# Altium project DCSupplyHub.PrjPcb
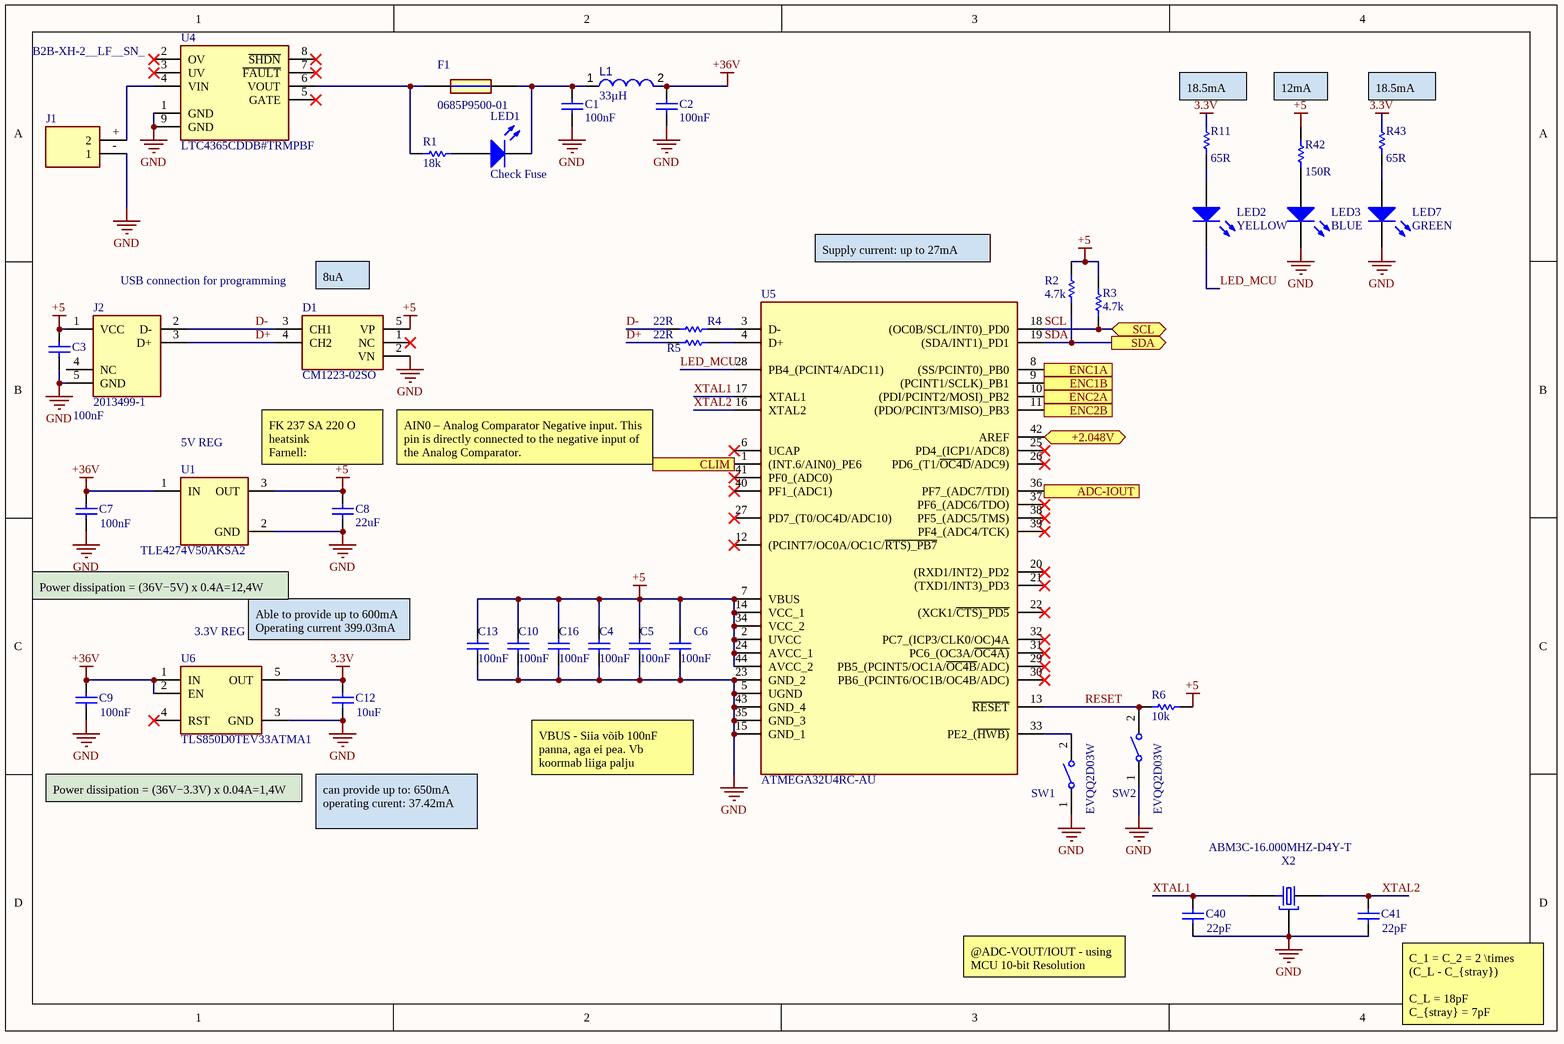
[diagram p0: v2-DCSupplyHub.SchDoc]
5 sheets, 113 parts. Net scope: flat (ports and power ports of the same name join across sheets).
Board files: DCSupplyHub-v2_20231213b.PcbDoc, DCSupplyHub-v2_20231212a.PcbDoc
Sheets:
  v2-DCSupplyHub.SchDoc
  LOG.SchDoc
  VCONV-DAC.SchDoc
  PWM-DAC-PSU.SchDoc
  output&ext-modules.SchDoc

## Sheet v2-DCSupplyHub.SchDoc
size A4; SheetNumber: 1; SheetTotal: 5

### Parts
C1  value 100nF  [Cap_0603]  (hidden comment: Cap)
C2  value 100nF  [Cap_0603]  (hidden comment: Cap)
C3  value 100nF  [Cap_0603]  (hidden comment: Cap)
C4  value 100nF  [Cap_0603]  (hidden comment: Cap)
C5  value 100nF  [Cap_0603]  (hidden comment: Cap)
C6  value 100nF  [Cap_0603]  (hidden comment: Cap)
C7  value 100nF  [Cap_0603]  (hidden comment: Cap)
C8  value 22uF  [Cap_0603]  (hidden comment: Cap)
C9  value 100nF  [Cap_0603]  (hidden comment: Cap)
C10  value 100nF  [Cap_0603]  (hidden comment: Cap)
C12  value 10uF  [Cap_0603]  (hidden comment: Cap)
C13  value 100nF  [Cap_0603]  (hidden comment: Cap)
C16  value 100nF  [Cap_0603]  (hidden comment: Cap)
C40  value 22pF  [Cap_0603]  (hidden comment: Cap)
C41  value 22pF  [Cap_0603]  (hidden comment: Cap)
D1  CM1223-02SO  [SOT95P280X145-5N]
F1  0685P9500-01  [FUSC3216X83N]  (value not drawn)
J1  B2B-XH-2__LF__SN_  [B2BXH2LFSN]
J2  2013499-1  [2013499-1]
L1  value 33µH  [WE-LQS 4018]  (hidden comment: 74404042330)
LED1  Check Fuse  [LED_SMD_0805_R]
LED2  YELLOW  [LED_SMD_0805_R]
LED3  BLUE  [LED_SMD_0805_R]
LED7  GREEN  [LED_SMD_0805_R]
R1  value 18k  [RES_0805]  (hidden comment: Res1)
R2  value 4.7k  [RES_0805]  (hidden comment: Res1)
R3  value 4.7k  [RES_0805]  (hidden comment: Res1)
R4  value 22R  [RES_0805]  (hidden comment: Res1)
R5  value 22R  [RES_0805]  (hidden comment: Res1)
R6  value 10k  [RES_0805]  (hidden comment: Res1)
R11  value 65R  [RES_0805]  (hidden comment: Res1)
R42  value 150R  [RES_0805]  (hidden comment: Res1)
R43  value 65R  [RES_0805]  (hidden comment: Res1)
SW1  EVQQ2D03W  [EVQQ2D03W]
SW2  EVQQ2D03W  [EVQQ2D03W]
U1  TLE4274V50AKSA2  [TO254P440X1000X2110-3P]
U4  LTC4365CDDB#PBF  [SON50P200X300X80-9N-D]  (value not drawn)
U5  ATMEGA32U4-AU  [QFP80P1200X1200X120-44N]  (value not drawn)
U6  TLS850D0TEV33ATMA1  [BTS6143D]
X2  ABM3C-16.000MHZ-D4Y-T  [ABM3C16000MHZD4YT]

### Ports
+2.048V (bidir), ADC-IOUT (in), CLIM (in), ENC1A (in), ENC1B (in), ENC2A (in), ENC2B (in), SCL (bidir), SDA (out)

### Nets
3.3V: C12.2 R11.1 R43.1 U6.5(OUT)
+5: C3.2 C4.2 C5.2 C6.2 C8.1 C10.2 C13.2 C16.2 D1.5(VP) J2.1(VCC) R2.2 R3.2 R6.1 R42.1 U1.3(OUT) U5.2(UVCC) U5.7(VBUS) U5.14(VCC_1) U5.24(AVCC_1) U5.34(VCC_2) U5.44(AVCC_2)
+36V: C2.1 C7.2 C9.2 L1.2 U1.1(IN) U6.1(IN) U6.2(EN)
GND: C1.2 C2.2 C3.1 C4.1 C5.1 C6.1 C7.1 C8.2 C9.1 C10.1 C12.1 C13.1 C16.1 C40.1 C41.1 D1.2(VN) J1.-(1) J2.5(GND) LED3.2(K) LED7.2(K) SW1.1 SW2.1 U1.2(GND) U4.1(GND) U4.9(GND) U5.5(UGND) U5.15(GND_1) U5.23(GND_2) U5.35(GND_3) U5.43(GND_4) U6.3(GND) X2.2(GND) X2.4(GND)
D+: D1.4(CH2) J2.3(D+) R5.2
D-: D1.3(CH1) J2.2(D-) R4.2
LED_MCU: LED2.2(K) U5.28(PB4_(PCINT4/ADC11))
RESET: R6.2 SW2.2 U5.13(~{RESET})
SCL: R3.1 U5.18((OC0B/SCL/INT0)_PD0) ; port SCL
SDA: R2.1 U5.19((SDA/INT1)_PD1) ; port SDA
XTAL1: C40.2 U5.17(XTAL1) X2.1
XTAL2: C41.2 U5.16(XTAL2) X2.3
NetC1_1: C1.1 F1.2 L1.1 LED1.2(K)
NetC28_1: U5.36(PF7_(ADC7/TDI)) ; port ADC-IOUT
NetC33_1: U5.8((SS/PCINT0)_PB0) ; port ENC1A
NetC34_1: U5.9((PCINT1/SCLK)_PB1) ; port ENC1B
NetC42_1: U5.10((PDI/PCINT2/MOSI)_PB2) ; port ENC2A
NetC43_1: U5.11((PDO/PCINT3/MISO)_PB3) ; port ENC2B
NetF1_1: F1.1 R1.2 U4.6(VOUT)
NetJ1_+: J1.+(2) U4.4(VIN)
NetLED1_1: LED1.1(A) R1.1
NetLED2_1: LED2.1(A) R11.2
NetLED3_1: LED3.1(A) R42.2
NetLED7_1: LED7.1(A) R43.2
NetQ2_1: U5.1((INT.6/AIN0)_PE6) ; port CLIM
NetR4_1: R4.1 U5.3(D-)
NetR5_1: R5.1 U5.4(D+)
NetSW1_2: SW1.2 U5.33(PE2_(~{HWB)})
NetU5_42: U5.42(AREF) ; port +2.048V

Not connected (* = marked no-connect by the designer): D1 1(NC)*; J2 4(NC); U4 2(OV)* 3(UV)* 5(GATE)* 7(~{FAULT})* 8(~{SHDN})*; U5 6(UCAP)* 12((PCINT7/OC0A/OC1C/~{RTS)_PB7})* 20((RXD1/INT2)_PD2)* 21((TXD1/INT3)_PD3)* 22((XCK1/~{CTS)_PD5})* 25(PD4_(ICP1/ADC8))* 26(PD6_(T1/~{OC4D}/ADC9))* 27(PD7_(T0/OC4D/ADC10))* 29(PB5_(PCINT5/OC1A/~{OC4B}/ADC))* 30(PB6_(PCINT6/OC1B/OC4B/ADC))* 31(PC6_(OC3A/~{OC4A)})* 32(PC7_(ICP3/CLK0/OC)4A)* 37(PF6_(ADC6/TDO))* 38(PF5_(ADC5/TMS))* 39(PF4_(ADC4/TCK))* 40(PF1_(ADC1))* 41(PF0_(ADC0))*; U6 4(RST)*

### Notes on the sheet
- (near R11) 18.5mA
- 12mA
- (near R43) 18.5mA
- USB connection for programming
- (near D1) 8uA
- Supply current: up to 27mA
- 5V REG
- FK 237 SA 220 O heatsink
  Farnell:
- AIN0 – Analog Comparator Negative input. This pin is directly connected to the negative input of the Analog Comparator.
- Power dissipation = (36V−5V) x 0.4A=12,4W
- (near U6) 3.3V REG
- Able to provide up to 600mA
  Operating current 399.03mA
- VBUS - Siia võib 100nF panna, aga ei pea. Vb koormab liiga palju
- Power dissipation = (36V−3.3V) x 0.04A=1,4W
- can provide up to: 650mA
  operating curent: 37.42mA
- @ADC-VOUT/IOUT - using MCU 10-bit Resolution
- (near C41) C_1 = C_2 = 2 \times (C_L - C_{stray})
  C_L = 18pF
  C_{stray} = 7pF
- (in symbol ATMEGA32U4-AU) ATMEGA32U4RC-AU
- (in symbol LTC4365CDDB#PBF) LTC4365CDDB#TRMPBF

### Library data of the parts
C1-C10 C12 C13 C16 C40 C41 = Cap: Capacitor; Published: 8-Jun-2000; LatestRevisionDate: 17-Jul-2002; LatestRevisionNote: Re-released for DXP Platform.; PackageReference: RAD-0.3; Publisher: Altium Limited; PackageDescription: Radial Cap, Thru-Hole; 2 Leads; 0.3 in Pin Spacing
D1 = CM1223-02SO: TVS Diode (Uni-directional); Manufacturer_Name: onsemi; Datasheet Link: https://www.onsemi.com/pdf/datasheet/cm1223-d.pdf; Height: 1.45mm; Manufacturer_Part_Number: CM1223-02SO; Mouser Part Number: 748-CM1223-02SO; Mouser Price/Stock: https://www.mouser.co.uk/ProductDetail/onsemi/CM1223-02SO?qs=lLuKAerq7nnvVg3rEtIojA%3D%3D; ComponentLink1Description: Datasheet; ComponentLink1URL: https://www.onsemi.com/pdf/datasheet/cm1223-d.pdf
F1 = 0685P9500-01: Fuse Chip Fast Acting 50A 32V SMD Solder Pad 1206 3.2 X 1.58 X 0.63mm Ceramic T/R; Manufacturer_Name: Bel Circuit Protection; Geometry.Height: 0.83mm; Manufacturer_Part_Number: 0685P9500-01; Mouser Part Number: *; Mouser Price/Stock: *; Arrow Part Number: 0685P9500-01; Arrow Price/Stock: https://www.arrow.com/en/products/0685p9500-01/bel-group?region=europe; Datasheet Link: https://www.arrow.com/en/products/0685p9500-01/bel-group
J1 = B2B-XH-2__LF__SN_: Connector; Manufacturer_Name: JST (JAPAN SOLDERLESS TERMINALS); Manufacturer_Part_Number: B2B-XH-2 (LF)(SN); Datasheet Link: http://uk.rs-online.com/web/p/products/1755297; Height: 7mm; Arrow Part Number: B2B-XH-2 (LF)(SN); Arrow Price/Stock: https://www.arrow.com/en/products/b2b-xh-2-lf-sn/jst-manufacturing?region=europe
J2 = 2013499-1: Connector; Manufacturer_Name: TE Connectivity; Datasheet Link: http://www.te.com/commerce/DocumentDelivery/DDEController?Action=showdoc&DocId=Customer+Drawing%7F2013499%7FB2%7Fpdf%7FEnglish%7FENG_CD_2013499_B2.pdf%7F2013499-1; Manufacturer_Part_Number: 2013499-1; Mouser Part Number: 571-2013499-1; Mouser Price/Stock: https://www.mouser.co.uk/ProductDetail/TE-Connectivity/2013499-1?qs=TL6PIybY3BOLK37GbUYdng%3D%3D; Arrow Part Number: 2013499-1; Arrow Price/Stock: https://www.arrow.com/en/products/2013499-1/te-connectivity?region=nac; ComponentLink1Description: Datasheet; ComponentLink1URL: https://cdn.amphenol-cs.com/media/wysiwyg/files/documentation/datasheet/inputoutput/io_usb_micro.pdf
L1 = CMP-006-00018-3: WE-LQS SMD Power Inductor, L=33 µH; Tolerance: 20%; ComponentLink2URL: http://katalog.we-online.de/pbs/datasheet/74404042330.pdf; ComponentLink1URL: http://www.we-online.com; ComponentLink2Description: Datasheet; Pins: 2; ComponentLink1Description: Manufacturer URL
LED1-LED3 LED7 = LED2: Typical RED, GREEN, YELLOW, AMBER GaAs LED; Published: 8-Jun-2000; LatestRevisionDate: 17-Jul-2002; LatestRevisionNote: Re-released for DXP Platform.; PackageVersion: Feb-2002; PackageReference: 3.2X1.6X1.1; Publisher: Altium Limited; PackageDescription: SM LED; 2 Flat Leads
R1-R6 R11 R42 R43 = Res1: Resistor; Published: 8-Jun-2000; LatestRevisionDate: 17-Jul-2002; LatestRevisionNote: Re-released for DXP Platform.; PackageReference: AXIAL-0.3; Publisher: Altium Limited; PackageDescription: Axial Device, Thru-Hole; 2 Leads; 0.3 in Pin Spacing
SW1 SW2 = SW-SPST-2_C: FSMSM Push Button Switch, 50 mA, -35 to 85 degC, 2-Pin SMD, RoHS, Tape and Reel; Manufacturer: TE Connectivity; Voltage Rating (DC): 24V; Electrical Life: 20000Cycles; Operating Force: 180gf; Switch Travel: 0.25mm; Contact Current Rating: 50mA; Case\/Package: SMD/SMT; Actuator Length: 1.07mm; Throw Configuration: SPST; Actuator Material: Polyamide; Contact Resistance: 100mOhm; Illumination Type: Illuminated; Max Voltage Rating (DC): 12V; Manufacturer URL: http://www.te.com/; Lead Free: LeadFree; Packaging: TapeandReel; Min Operating Temperature: -35degC; Mechanical Life: 20000Cycles; Mount: SurfaceMount; REACH SVHC: Unknown; Package Quantity: 1800; Package Reference: FSMSMTR; RoHSCompliant: true; Max Operating Temperature: 85degC; Orientation: Straight; ELV: Compliant; Datasheet URL: http://www.te.com/commerce/DocumentDelivery/DDEController?Action=showdoc&DocId=Customer+Drawing%7F1437566-3%7FC2%7Fpdf%7FEnglish%7FENG_CD_1437566-3_C2_1437566_3_1_c.dwg.pdf%7F1437566-4; Package Description: 2-Pin Surface Mount Device, Body 6 x 3.5 mm, Pitch 9.19 mm; Current Rating: 50mA; Contact Plating: Silver; Termination: GullWing; Datasheet Version: Rev. C2, 08/2014; Contact Material: Brass; Mounting Technology: SurfaceMount; ComponentLink1Description: Datasheet; ComponentLink1URL: https://www.farnell.com/datasheets/2244072.pdf
U1 = TLE4274DV50ATMA2: LDO, FIXED, 5V, 0.4A, -40 TO 150DEG C; Manufacturer_Name: Infineon; Datasheet Link: https://www.mouser.com/datasheet/2/196/Infineon-TLE4274-DS-v01_70-EN-1133217.pdf; Height: 2mm; Manufacturer_Part_Number: TLE4274DV50ATMA2; Mouser Part Number: 726-TLE4274DV50ATMA2; Mouser Price/Stock: https://www.mouser.co.uk/ProductDetail/Infineon-Technologies/TLE4274DV50ATMA2/?qs=IxCaM9nJKKWmxkR9ksyK2Q%3D%3D; Arrow Part Number: TLE4274DV50ATMA2; Arrow Price/Stock: https://www.arrow.com/en/products/tle4274dv50atma2/infineon-technologies-ag?region=nac; ComponentLink1Description: Datasheet; ComponentLink1URL: https://www.mouser.com/datasheet/2/196/Infineon-TLE4274-DS-v01_70-EN-1133217.pdf
U4 = LTC4365CDDB#PBF: vervoltage, Undervoltage and Reverse Supply Protection Controller; Manufacturer_Name: Analog Devices; Datasheet Link: http://cds.linear.com/docs/en/datasheet/4365fa.pdf; Height: 0.8mm; Manufacturer_Part_Number: LTC4365CDDB#PBF; Mouser Part Number: 584-LTC4365CDDB#PBF; Mouser Price/Stock: https://www.mouser.com/Search/Refine.aspx?Keyword=584-LTC4365CDDB%23PBF; ComponentLink1Description: Datasheet; ComponentLink1URL: https://www.analog.com/media/en/technical-documentation/data-sheets/LTC4365.pdf
U5 = ATMEGA32U4-AU: MCU AVR 32K FLASH 16MHZ 44-TQFP Atmel ATMEGA32U4-AU, 8bit AVR Microcontroller, 16MHz, 1 kB, 32 kB Flash, 44-Pin TQFP; Manufacturer_Name: Microchip; Geometry.Height: 1.2mm; Manufacturer_Part_Number: ATMEGA32U4-AU; Mouser Part Number: 556-ATMEGA32U4-AU; Mouser Price/Stock: https://www.mouser.co.uk/ProductDetail/Microchip-Technology/ATMEGA32U4-AU?qs=SSucg2PyLi7mKWjHIsNJ3w%3D%3D; Arrow Part Number: ATMEGA32U4-AU; Arrow Price/Stock: https://www.arrow.com/en/products/atmega32u4-au/microchip-technology?region=nac; Datasheet Link: http://www.atmel.com/images/atmel-7766-8-bit-avr-atmega16u4-32u4_summary.pdf; ComponentLink1Description: Datasheet; ComponentLink1URL: https://ww1.microchip.com/downloads/en/DeviceDoc/Atmel-7766-8-bit-AVR-ATmega16U4-32U4_Datasheet.pdf
U6 = TLS850D0TEV33ATMA1: LDO VOltage regulator; Manufacturer_Name: Infineon; Datasheet Link: https://www.arrow.com/en/products/tls850d0tev33atma1/infineon-technologies-ag; Height: 2mm; Manufacturer_Part_Number: TLS850D0TEV33ATMA1; Mouser Part Number: 726-TLS850D0TEV33ATM; Mouser Price/Stock: https://www.mouser.co.uk/ProductDetail/Infineon-Technologies/TLS850D0TEV33ATMA1?qs=lJkB7%252BtQNiOAXKJxyf22ag%3D%3D; Arrow Part Number: TLS850D0TEV33ATMA1; Arrow Price/Stock: https://www.arrow.com/en/products/tls850d0tev33atma1/infineon-technologies-ag; ComponentLink1Description: Datasheet; ComponentLink1URL: https://4donline.ihs.com/images/VipMasterIC/IC/INFN/INFN-S-A0003268371/INFN-S-A0003268371-1.pdf?hkey=6D3A4C79FDBF58556ACFDE234799DDF0
X2 = ABM3C-16.000MHZ-D4Y-T: 16MHz Â±30ppm Crystal 18pF 50 Ohms 4-SMD, No Lead; MF: Abracon; Price: None; Value: *; Package: SMD-4 Abracon; Availability: Unavailable; SnapEDA_Link: https://www.snapeda.com/parts/ABM3C-16.000MHZ-D4Y-T/Abracon%20LLC/view-part/463692/?ref=snap; MP: ABM3C-16.000MHZ-D4Y-T; Supplier 1: Arrow Electronics; Supplier Part Number 1: ABM3C-16.000MHZ-D4Y-T; ComponentLink1Description: Datasheet; ComponentLink1URL: https://www.mouser.ee/datasheet/2/3/abm3c-1775120.pdf

## Sheet LOG.SchDoc
size A4; SheetNumber: 2; SheetTotal: 5
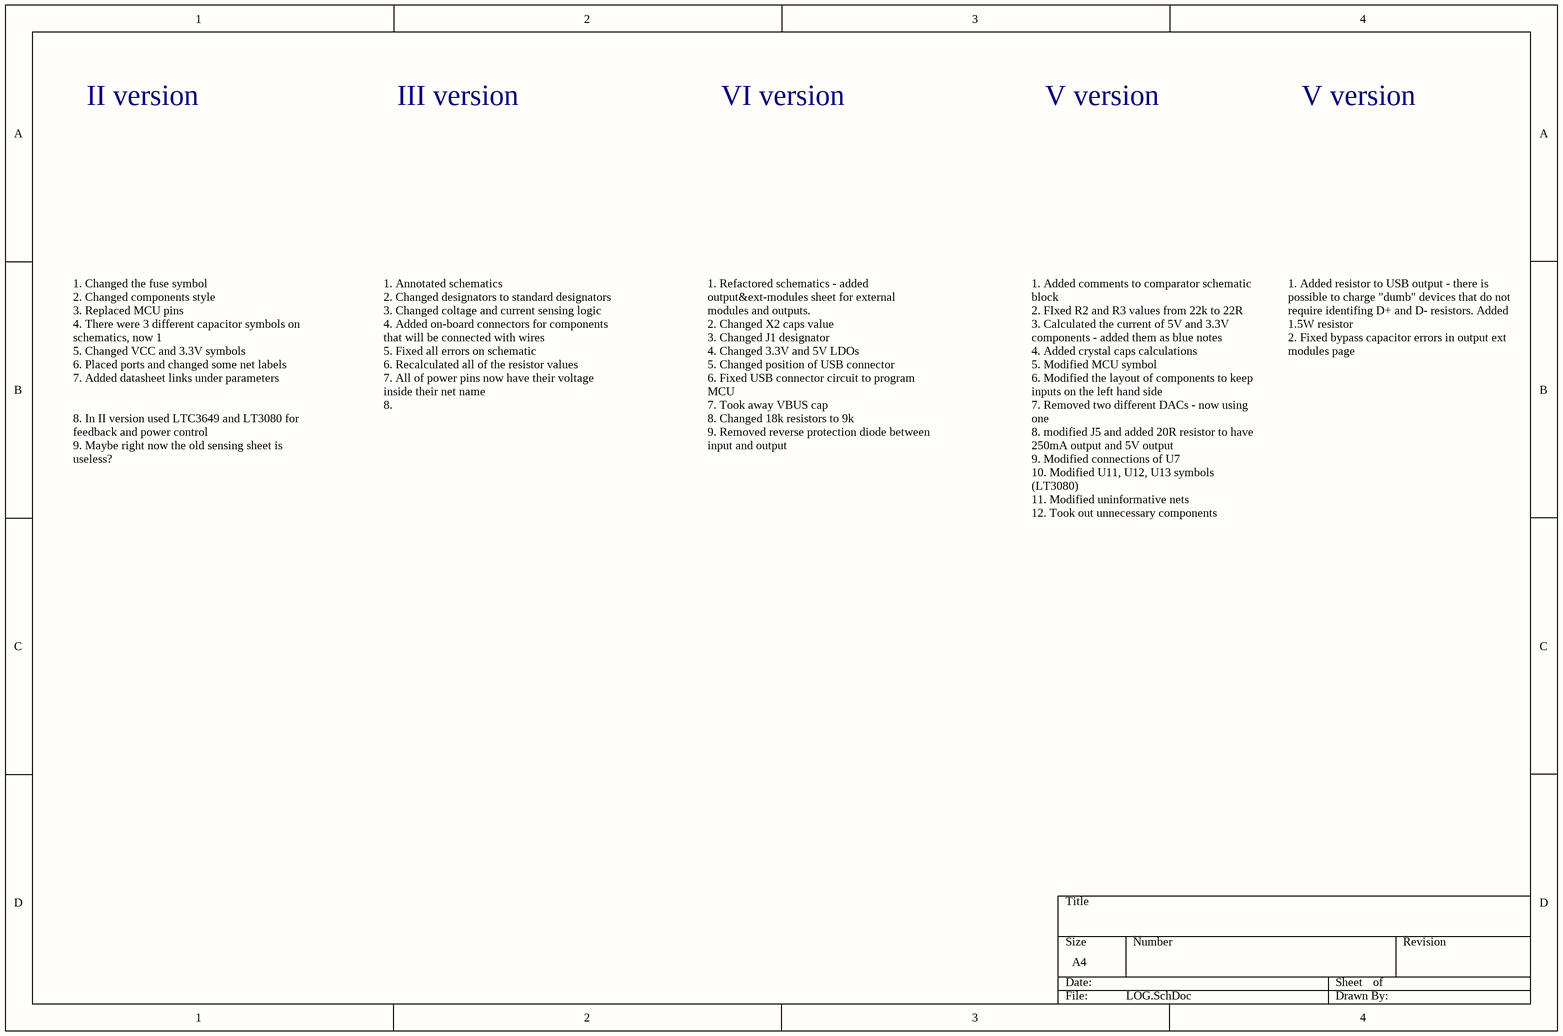
[diagram p1: LOG.SchDoc]

### Notes on the sheet
- II version
- III version
- VI version
- V version
- 1. Changed the fuse symbol
  2. Changed components style
  3. Replaced MCU pins
  4. There were 3 different capacitor symbols on schematics, now 1
  5. Changed VCC and 3.3V symbols
  6. Placed ports and changed some net labels
  7. Added datasheet links under parameters
  8. In II version used LTC3649 and LT3080 for feedback and power control
  9. Maybe right now the old sensing sheet is useless?
- 1. Annotated schematics
  2. Changed designators to standard designators
  3. Changed coltage and current sensing logic
  4. Added on-board connectors for components that will be connected with wires
  5. Fixed all errors on schematic
  6. Recalculated all of the resistor values
  7. All of power pins now have their voltage inside their net name
  8.
- 1. Refactored schematics - added output&ext-modules sheet for external modules and outputs.
  2. Changed X2 caps value
  3. Changed J1 designator
  4. Changed 3.3V and 5V LDOs
  5. Changed position of USB connector
  6. Fixed USB connector circuit to program MCU
  7. Took away VBUS cap
  8. Changed 18k resistors to 9k
  9. Removed reverse protection diode between input and output
- 1. Added comments to comparator schematic block
  2. FIxed R2 and R3 values from 22k to 22R
  3. Calculated the current of 5V and 3.3V components - added them as blue notes
  4. Added crystal caps calculations
  5. Modified MCU symbol
  6. Modified the layout of components to keep inputs on the left hand side
  7. Removed two different DACs - now using one
  8. modified J5 and added 20R resistor to have 250mA output and 5V output
  9. Modified connections of U7
  10. Modified U11, U12, U13 symbols (LT3080)
  11. Modified uninformative nets
  12. Took out unnecessary components
- 1. Added resistor to USB output - there is possible to charge "dumb" devices that do not require identifing D+ and D- resistors. Added 1.5W resistor
  2. Fixed bypass capacitor errors in output ext modules page

## Sheet VCONV-DAC.SchDoc
size A4; SheetNumber: 3; SheetTotal: 5
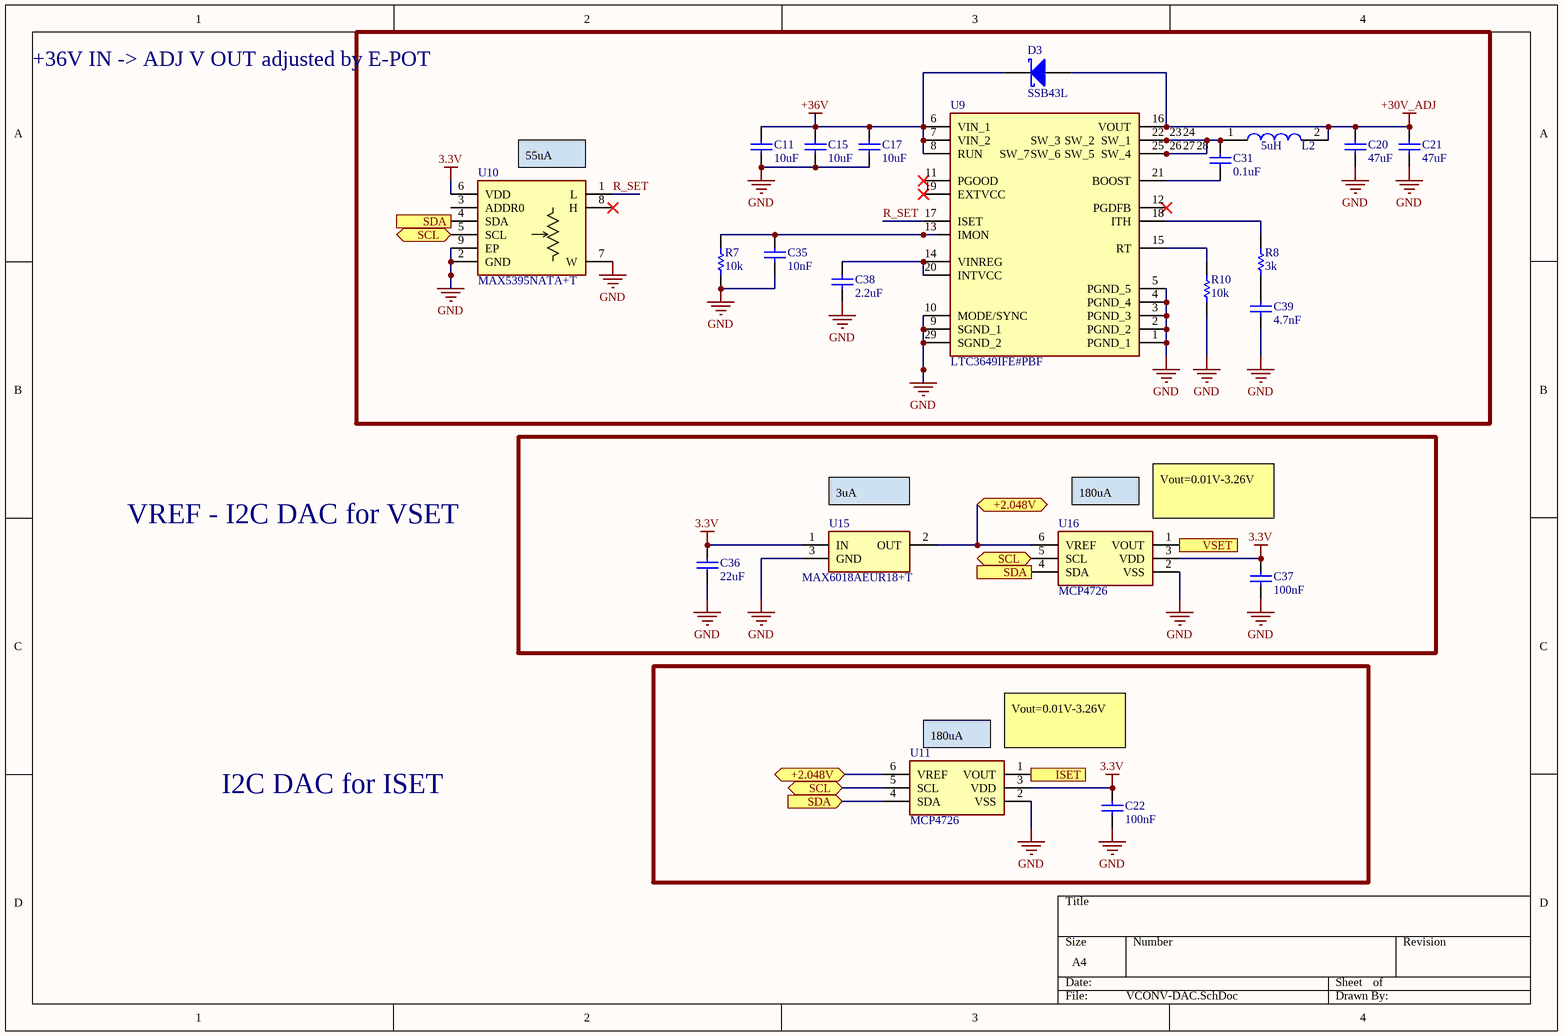
[diagram p2: VCONV-DAC.SchDoc]

### Parts
C11  value 10uF  [Cap_0603]  (hidden comment: Cap)
C15  value 10uF  [Cap_0603]  (hidden comment: Cap)
C17  value 10uF  [Cap_0603]  (hidden comment: Cap)
C20  value 47uF  [Cap_0603]  (hidden comment: Cap)
C21  value 47uF  [Cap_0603]  (hidden comment: Cap)
C22  value 100nF  [Cap_0603]  (hidden comment: Cap)
C31  value 0.1uF  [Cap_0603]  (hidden comment: Cap)
C35  value 10nF  [Cap_0603]  (hidden comment: Cap)
C36  value 22uF  [Cap_0603]  (hidden comment: Cap)
C37  value 100nF  [Cap_0603]  (hidden comment: Cap)
C38  value 2.2uF  [Cap_0603]  (hidden comment: Cap)
C39  value 4.7nF  [Cap_0603]  (hidden comment: Cap)
D3  SSB43L  [DO-214AA(SMB)]
L2  5uH  [IND_TCK-141_TRP]
R7  value 10k  [RES_0805]  (hidden comment: Res1)
R8  value 3k  [RES_0805]  (hidden comment: Res1)
R10  value 10k  [RES_0805]  (hidden comment: Res1)
U9  LTC3649IFE#PBF  [SOP65P640X120-29N]
U10  MAX5395NATA+T  [SON50P200X200X80-9N-D]
U11  MCP4726  [SOT95P270X145-6N]
U15  MAX6018AEUR18+T  [SOT95P237X112-3N]
U16  MCP4726  [SOT95P270X145-6N]

### Ports
+2.048V (bidir), ISET (out), SCL (bidir), SDA (in), VSET (out)

### Nets
3.3V: C22.1 C36.1 C37.1 U10.6(VDD) U11.3(VDD) U15.1(IN) U16.3(VDD)
+30V_ADJ: C20.1 C21.1 D3.A L2.2 U9.16(VOUT)
+36V: C11.1 C15.1 C17.1 D3.K U9.6(VIN_1) U9.7(VIN_2) U9.8(RUN)
GND: C11.2 C15.2 C17.2 C20.2 C21.2 C22.2 C35.2 C36.2 C37.2 C38.2 C39.2 R7.1 R10.1 U9.1(PGND_1) U9.2(PGND_2) U9.3(PGND_3) U9.4(PGND_4) U9.5(PGND_5) U9.9(SGND_1) U9.10(MODE/SYNC) U9.29(SGND_2) U10.2(GND) U10.7(W) U10.9(EP) U11.2(VSS) U15.3(GND) U16.2(VSS)
R_SET: U9.17(ISET) U10.1(L)
SCL: U10.5(SCL) U11.5(SCL) U16.5(SCL) ; port SCL
SDA: U10.4(SDA) U11.4(SDA) U16.4(SDA) ; port SDA
NetC31_1: C31.1 L2.1 U9.22(SW_1) U9.23(SW_2) U9.24(SW_3) U9.25(SW_4) U9.26(SW_5) U9.27(SW_6) U9.28(SW_7)
NetC31_2: C31.2 U9.21(BOOST)
NetC35_1: C35.1 R7.2 U9.13(IMON)
NetC38_1: C38.1 U9.14(VINREG) U9.20(INTVCC)
NetC39_1: C39.1 R8.1
NetR8_2: R8.2 U9.18(ITH)
NetR10_2: R10.2 U9.15(RT)
NetR32_2: U11.1(VOUT) ; port ISET
NetU3_3: U16.1(VOUT) ; port VSET
NetU5_42: U11.6(VREF) U15.2(OUT) U16.6(VREF) ; port +2.048V

Not connected (* = marked no-connect by the designer): U9 11(PGOOD)* 12(PGDFB)* 19(EXTVCC)*; U10 3(ADDR0) 8(H)*

### Notes on the sheet
- +36V IN -> ADJ V OUT adjusted by E-POT
- (near U10) 55uA
- (near U15) 3uA
- (near U16) 180uA
- (near U16) Vout=0.01V-3.26V
- VREF - I2C DAC for VSET
- (near U11) 180uA
- (near U11) Vout=0.01V-3.26V
- I2C DAC for ISET

### Library data of the parts
C11 C15 C17 C20-C22 C31 C35-C39 = Cap: Capacitor; Published: 8-Jun-2000; LatestRevisionDate: 17-Jul-2002; LatestRevisionNote: Re-released for DXP Platform.; PackageReference: RAD-0.3; Publisher: Altium Limited; PackageDescription: Radial Cap, Thru-Hole; 2 Leads; 0.3 in Pin Spacing
D3 = SSB43L: Schottky Rectifier, 40 V, 4 A, Single, DO-214AA (SMB), 2 Pins, 490 mV; Supplier 1: Farnell; Supplier Part Number 1: 1336556; ComponentLink1Description: Datasheet; ComponentLink1URL: https://4donline.ihs.com/images/VipMasterIC/IC/VISH/VISH-S-A0010452954/VISH-S-A0010476709-1.pdf?hkey=6D3A4C79FDBF58556ACFDE234799DDF0
L2 = TCK-141: FIXED IND 5.6UH 3.5A 90MOHM SMD; Mfr_Name: Traco Power; Type: DEV; Copyright: Copyright (C) 2023 Ultra Librarian. All rights reserved.; Manufacturer_Part_Number: TCK-141; RefDes: RefDes; ComponentLink1Description: Datasheet; ComponentLink1URL: https://www.tracopower.com/products/tck141.pdf
R7 R8 R10 = Res1: Resistor; Published: 8-Jun-2000; LatestRevisionDate: 17-Jul-2002; LatestRevisionNote: Re-released for DXP Platform.; PackageReference: AXIAL-0.3; Publisher: Altium Limited; PackageDescription: Axial Device, Thru-Hole; 2 Leads; 0.3 in Pin Spacing
U9 = LTC3649IFE#PBF: 60V, 4A Synchronous Step-Down Regulator with Rail-to-Rail Programmable Output; Manufacturer_Name: Analog Devices; Geometry.Height: 1.2mm; Manufacturer_Part_Number: LTC3649IFE#PBF; Mouser Part Number: 584-LTC3649IFE#PBF; Mouser Price/Stock: https://www.mouser.co.uk/ProductDetail/Analog-Devices/LTC3649IFEPBF?qs=oahfZPh6IALghjzowGYuFA%3D%3D; Arrow Part Number: LTC3649IFE#PBF; Arrow Price/Stock: https://www.arrow.com/en/products/ltc3649ifepbf/linear-technology; Datasheet Link: http://www.analog.com/media/en/technical-documentation/data-sheets/3649fb.pdf; Supplier 1: Digi-Key; Supplier Part Number 1: LTC3649IFE#PBF-ND; ComponentLink1Description: Datasheet; ComponentLink1URL: https://www.analog.com/media/en/technical-documentation/data-sheets/3649fb.pdf
U10 = MAX5395NATA+T: ingle, 256-Tap Volatile, I2C, Low-Voltage Linear / Taper Digital Potentiometer; Manufacturer_Name: Analog Devices; Datasheet Link: https://datasheets.maximintegrated.com/en/ds/MAX5395.pdf; Height: 0.8mm; Manufacturer_Part_Number: MAX5395NATA+T; Mouser Part Number: 700-MAX5395NATA+T; Mouser Price/Stock: https://www.mouser.co.uk/ProductDetail/Analog-Devices-Maxim-Integrated/MAX5395NATA%2bT?qs=0JU57JYmZjt6U4d8%252BEwekw%3D%3D; ComponentLink1Description: Datasheet; ComponentLink1URL: https://www.farnell.com/datasheets/2297485.pdf
U11 U16 = MCP4725A0T-E_CH: 12-Bit Digital-to-Analog Converter with EEPROM Memory; Manufacturer_Name: Microchip; Manufacturer_Part_Number: MCP4725A0T-E/CH; Datasheet Link: http://ww1.microchip.com/downloads/en/DeviceDoc/22039d.pdf; Height: 1.45mm; Mouser Part Number: 579-MCP4725A0TECH; Mouser Price/Stock: https://www.mouser.co.uk/ProductDetail/Microchip-Technology/MCP4725A0T-E-CH?qs=vkMqrgFpRajeQECZ3goc0A%3D%3D; Arrow Part Number: MCP4725A0T-E/CH; Arrow Price/Stock: https://www.arrow.com/en/products/mcp4725a0t-ech/microchip-technology?region=nac; ComponentLink1Description: Datasheet; ComponentLink1URL: http://ww1.microchip.com/downloads/en/DeviceDoc/22039d.pdf
U15 = MAX6018AEUR18+T: Precision, Micropower, 1.8V Supply, / Low-Dropout, SOT23 Voltage Reference; Manufacturer_Name: Analog Devices; Datasheet Link: https://datasheets.maximintegrated.com/en/ds/MAX6018-MAX6018B.pdf; Height: 1.12mm; Manufacturer_Part_Number: MAX6018AEUR18+T; Mouser Part Number: 700-MAX6018AEUR18T; Mouser Price/Stock: https://www.mouser.co.uk/ProductDetail/Maxim-Integrated/MAX6018AEUR18%2bT?qs=GxOUx7aO6nxTHpj7gtPQaw%3D%3D; ComponentLink1Description: Datasheet; ComponentLink1URL: https://datasheets.maximintegrated.com/en/ds/MAX6018-MAX6018B.pdf

## Sheet PWM-DAC-PSU.SchDoc
size A4; SheetNumber: 4; SheetTotal: 5
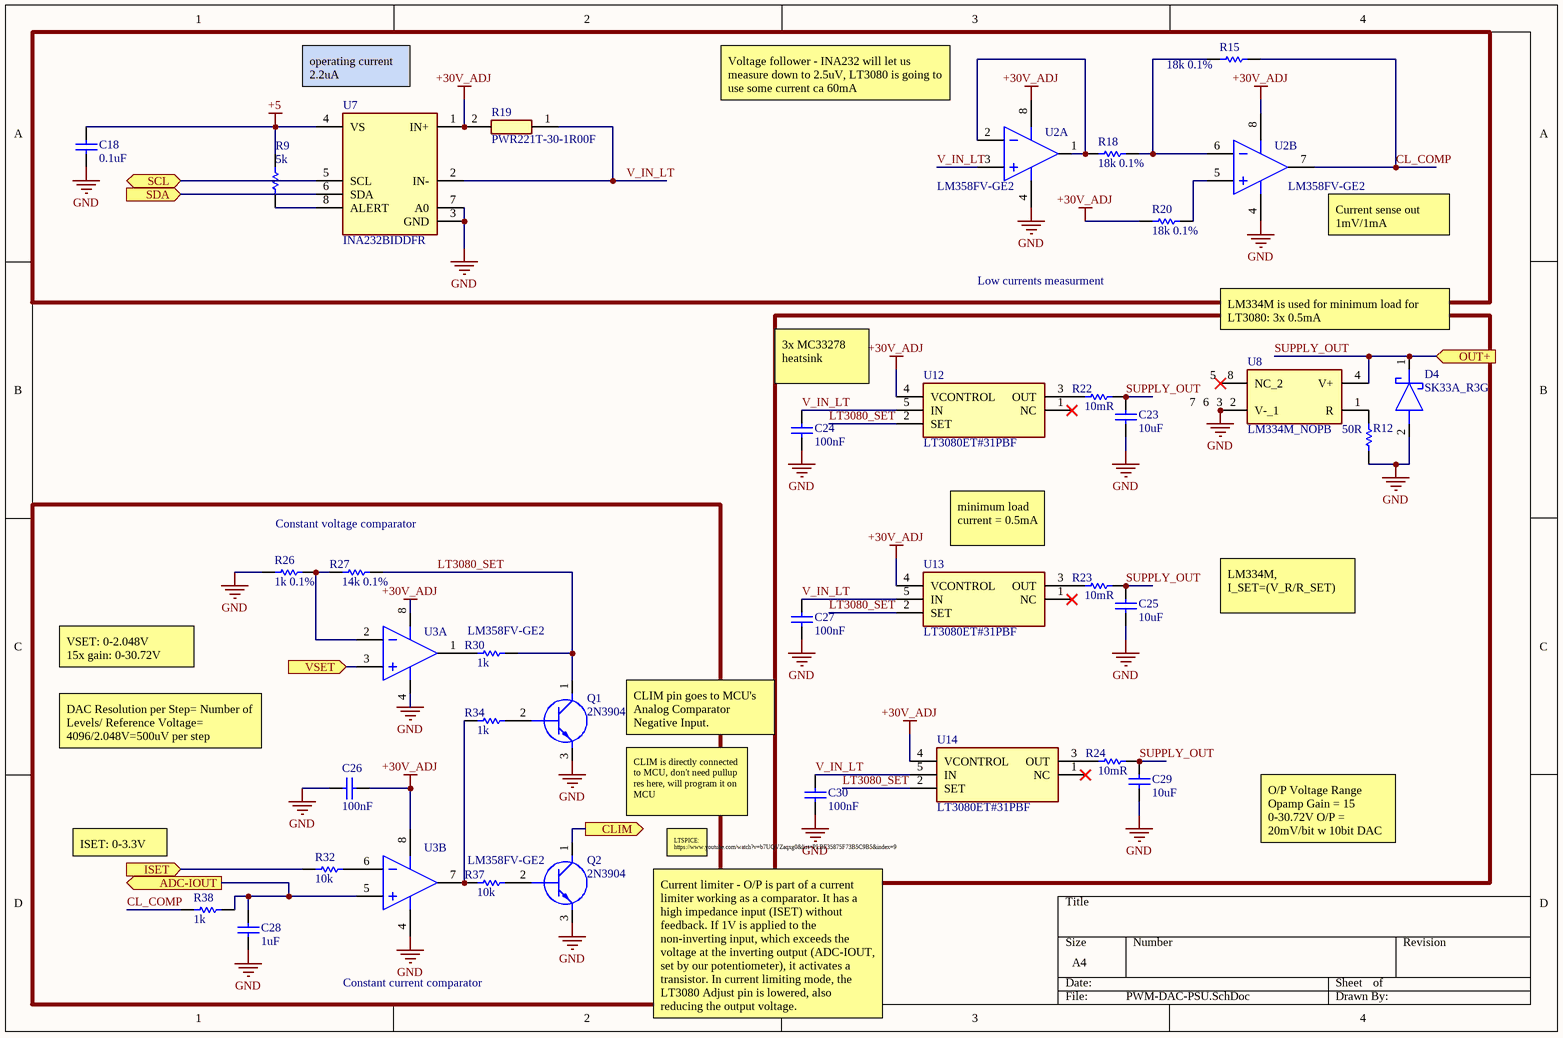
[diagram p3: PWM-DAC-PSU.SchDoc]

### Parts
C18  value 0.1uF  [Cap_0603]  (hidden comment: Cap)
C23  value 10uF  [Cap_0603]  (hidden comment: Cap)
C24  value 100nF  [Cap_0603]  (hidden comment: Cap)
C25  value 10uF  [Cap_0603]  (hidden comment: Cap)
C26  value 100nF  [Cap_0603]  (hidden comment: Cap)
C27  value 100nF  [Cap_0603]  (hidden comment: Cap)
C28  value 1uF  [Cap_0603]  (hidden comment: Cap)
C29  value 10uF  [Cap_0603]  (hidden comment: Cap)
C30  value 100nF  [Cap_0603]  (hidden comment: Cap)
D4  SK33A_R3G  [DIOM5126X250N]
Q1  2N3904  [LM431ACZ]
Q2  2N3904  [LM431ACZ]
R9  value 5k  [RES_0805]  (hidden comment: Res1)
R12  value 50R  [RES_0805]  (hidden comment: Res1)
R15  value 18k 0.1%  [RES_0805]  (hidden comment: Res1)
R18  value 18k 0.1%  [RES_0805]  (hidden comment: Res1)
R19  PWR221T-30-1R00F  [TO508P343X1041X1930-2P]
R20  value 18k 0.1%  [RES_0805]  (hidden comment: Res1)
R22  value 10mR  [RES_0805]  (hidden comment: Res1)
R23  value 10mR  [RES_0805]  (hidden comment: Res1)
R24  value 10mR  [RES_0805]  (hidden comment: Res1)
R26  value 1k 0.1%  [RES_0805]  (hidden comment: Res1)
R27  value 14k 0.1%  [RES_0805]  (hidden comment: Res1)
R30  value 1k  [RES_0805]  (hidden comment: Res1)
R32  value 10k  [RES_0805]  (hidden comment: Res1)
R34  value 1k  [RES_0805]  (hidden comment: Res1)
R37  value 10k  [RES_0805]  (hidden comment: Res1)
R38  value 1k  [RES_0805]  (hidden comment: Res1)
U2  LM358FV-GE2  [SOP65P640X135-8N]  (parts A,B of 2)
U3  LM358FV-GE2  [SOP65P640X135-8N]  (parts A,B of 2)
U7  INA232BIDDFR  [SOT65P280X110-8N]
U8  LM334M_NOPB  [SOIC127P600X175-8N]
U12  LT3080ET#31PBF  [LT3080ET31PBF]
U13  LT3080ET#31PBF  [LT3080ET31PBF]
U14  LT3080ET#31PBF  [LT3080ET31PBF]

### Blocks framed on the sheet
Low currents measurment: C18 R9 R15 R18-R20 U2 U7

### Ports
ADC-IOUT (out), CLIM (out), ISET (in), OUT+ (in), SCL (bidir), SDA (in), VSET (in)

### Nets
+5: C18.1 R9.2 U7.4(VS)
+30V_ADJ: C26.2 R19.2 R20.2 U2.8(VCC) U3.8(VCC) U7.1(IN+) U12.4(VCONTROL) U13.4(VCONTROL) U14.4(VCONTROL)
GND: C18.2 C23.1 C24.2 C25.1 C26.1 C27.2 C28.2 C29.1 C30.2 D4.2(A) Q1.3(E) Q2.3(E) R12.2 R26.1 U2.4(GND) U3.4(GND) U7.3(GND) U7.7(A0) U8.2(V-_1) U8.3(V-_2) U8.6(V-_3) U8.7(V-_4)
CL_COMP: R15.2 R38.1 U2.7(2OUT)
LT3080_SET: Q1.1(C) R27.2 R30.2 U12.2(SET) U13.2(SET) U14.2(SET)
SCL: U7.5(SCL) ; port SCL
SDA: U7.6(SDA) ; port SDA
SUPPLY_OUT: C23.2 C25.2 C29.2 D4.1(K) R22.1 R23.1 R24.1 U8.4(V+) ; port OUT+
V_IN_LT: C24.1 C27.1 C30.1 R19.1 U2.3(1IN+) U7.2(IN-) U12.5(IN) U13.5(IN) U14.5(IN)
NetC28_1: C28.1 R38.2 U3.5(2IN+) ; port ADC-IOUT
NetQ1_2: Q1.2(B) R34.2
NetQ2_1: Q2.1(C) ; port CLIM
NetQ2_2: Q2.2(B) R37.2
NetR9_1: R9.1 U7.8(ALERT)
NetR12_1: R12.1 U8.1(R)
NetR15_1: R15.1 R18.2 U2.6(2IN-)
NetR18_1: R18.1 U2.1(1OUT) U2.2(1IN-)
NetR20_1: R20.1 U2.5(2IN+)
NetR22_2: R22.2 U12.3(OUT)
NetR23_2: R23.2 U13.3(OUT)
NetR24_2: R24.2 U14.3(OUT)
NetR26_2: R26.2 R27.1 U3.2(1IN-)
NetR30_1: R30.1 U3.1(1OUT)
NetR32_1: R32.1 U3.6(2IN-)
NetR32_2: R32.2 ; port ISET
NetR34_1: R34.1 R37.1 U3.7(2OUT)
NetU3_3: U3.3(1IN+) ; port VSET
NetU8_5: U8.5(NC_1) U8.8(NC_2)

Not connected (* = marked no-connect by the designer): U12 1(NC)*; U13 1(NC)*; U14 1(NC)*

### Notes on the sheet
- (near U7) operating current 2.2uA
- Voltage follower - INA232 will let us measure down to 2.5uV, LT3080 is going to use some current ca 60mA
- (near U2) Current sense out
  1mV/1mA
- 3x MC33278 heatsink
- LM334M is used for minimum load for LT3080: 3x 0.5mA
- Constant voltage comparator
- minimum load current = 0.5mA
- LM334M, I_SET=(V_R/R_SET)
- VSET: 0-2.048V
  15x gain: 0-30.72V
- DAC Resolution per Step= Number of Levels/ Reference Voltage=
  4096/2.048V=500uV per step
  ​
- CLIM pin goes to MCU's Analog Comparator Negative Input.
- ISET: 0-3.3V
- CLIM is directly connected to MCU, don't need pullup res here, will program it on MCU
- LTSPICE: https://www.youtube.com/watch?v=b7UQVZaqxg0&list=PLBF35875F73B5C9B5&index=9
- O/P Voltage Range
  Opamp Gain = 15
  0-30.72V O/P = 20mV/bit w 10bit DAC
- Constant current comparator
- Current limiter - O/P is part of a current limiter working as a comparator. It has a high impedance input (ISET) without feedback. If 1V is applied to the non-inverting input, which exceeds the voltage at the inverting output (ADC-IOUT, set by our potentiometer), it activates a transistor. In current limiting mode, the LT3080 Adjust pin is lowered, also reducing the output voltage.

### Library data of the parts
C18 C23-C30 = Cap: Capacitor; Published: 8-Jun-2000; LatestRevisionDate: 17-Jul-2002; LatestRevisionNote: Re-released for DXP Platform.; PackageReference: RAD-0.3; Publisher: Altium Limited; PackageDescription: Radial Cap, Thru-Hole; 2 Leads; 0.3 in Pin Spacing
D4 = SK33A_R3G: Schottky Diode; Manufacturer_Name: Taiwan Semiconductor; Manufacturer_Part_Number: SK33A R3G; Datasheet Link: https://eu.mouser.com/datasheet/2/395/SK32A%20SERIES_T1705-1140381.pdf; Height: 2.5mm; Mouser Part Number: 821-SK33AR3G; Mouser Price/Stock: https://www.mouser.co.uk/ProductDetail/Taiwan-Semiconductor/SK33A-R3G?qs=u4fy%2FsgLU9MRgnm6RX6lAA%3D%3D
Q1 Q2 = 2N3904BU: Transistor BJT NPN; Manufacturer_Name: onsemi; Datasheet Link: http://www.onsemi.com/pub/Collateral/2N3904-D.pdf; Height: 5.33mm; Manufacturer_Part_Number: 2N3904BU; Mouser Part Number: 512-2N3904BU; Mouser Price/Stock: https://www.mouser.co.uk/ProductDetail/onsemi-Fairchild/2N3904BU?qs=or4AE2qAS%252Bd0Jdpn%2F8ktKg%3D%3D; Arrow Part Number: 2N3904BU; Arrow Price/Stock: https://www.arrow.com/en/products/2n3904bu/on-semiconductor?region=europe; ComponentLink1Description: Datasheet; ComponentLink1URL: http://www.onsemi.com/pub/Collateral/2N3904-D.pdf
R9 R12 R15 R18 R20 R22-R24 R26 R27 R30 R32 R34 R37 R38 = Res1: Resistor; Published: 8-Jun-2000; LatestRevisionDate: 17-Jul-2002; LatestRevisionNote: Re-released for DXP Platform.; PackageReference: AXIAL-0.3; Publisher: Altium Limited; PackageDescription: Axial Device, Thru-Hole; 2 Leads; 0.3 in Pin Spacing
R19 = PWR221T-30-1R00F: Shunt resistor; Manufacturer_Name: Bourns; Datasheet Link: https://www.mouser.com/datasheet/2/54/pwr221t-30-777826.pdf; Height: 3.43mm; Manufacturer_Part_Number: PWR221T-30-1R00F; Mouser Part Number: 652-PWR221T-30-1R00F; Mouser Price/Stock: https://www.mouser.co.uk/ProductDetail/Bourns/PWR221T-30-1R00F?qs=XYAu1o%252BHdOJGOBAldPrG1w%3D%3D; Arrow Part Number: PWR221T-30-1R00F; Arrow Price/Stock: https://www.arrow.com/en/products/pwr221t-30-1r00f/bourns; ComponentLink1Description: Datasheet; ComponentLink1URL: https://www.mouser.com/datasheet/2/54/pwr221t-30-777826.pdf
U2 U3 = TI-LM358-8: l Operational Amplifier; ComponentLink1Description: Datasheet; ComponentLink1URL: https://www.ti.com/lit/ds/symlink/lm358.pdf?ts=1699359399522&ref_url=https%253A%252F%252Fwww.ti.com%252Fproduct%252FLM358%253Futm_source%253Dgoogle%2526utm_medium%253Dcpc%2526utm_campaign%253Dasc-null-null-GPN_EN-cpc-evm-google-wwe_cons%2526utm_content%253DLM358%2526ds_k%253DLM358%2BDatasheet%2526DCM%253Dyes%2526gclid%253DEAIaIQobChMI5uKEhe-xggMVJz4GAB1MywkTEAAYASAAEgJG8PD_BwE%2526gclsrc%253Daw.ds
  U3: Parameter 1: *; Supplier 1: Rs; Supplier Part Number 1: 1716341
U7 = INA232BIDDFR: INA232 48-V, 16-Bit, Current, Voltage, and Power Monitor With an I2C Interface; Manufacturer_Name: Texas Instruments; Datasheet Link: https://www.ti.com/lit/ds/symlink/ina232.pdf?ts=1699312390876&ref_url=https%253A%252F%252Fwww.ti.com%252Fproduct%252FINA232%253Futm_source%253Dgoogle%2526utm_medium%253Dcpc%2526utm_campaign%253Dasc-null-null-GPN_EN-cpc-pf-google-wwe_cons%2526utm_content%2; Height: 1.1mm; Manufacturer_Part_Number: INA232BIDDFR; Mouser Part Number: 595-INA232BIDDFR; Mouser Price/Stock: https://www.mouser.co.uk/ProductDetail/Texas-Instruments/INA232BIDDFR?qs=17ckDYBRdelmwH1njZdaQw%3D%3D; ComponentLink1Description: Datahseet; ComponentLink1URL: https://www.ti.com/lit/ds/symlink/ina232.pdf?HQS=dis-mous-null-mousermode-dsf-pf-null-wwe&ts=1700934645658&ref_url=https%253A%252F%252Fwww.mouser.com%252F
U8 = LM334M_NOPB: 3-Terminal Adjustable Current Source; Manufacturer_Name: Texas Instruments; Manufacturer_Part_Number: LM334M/NOPB; Datasheet Link: http://www.ti.com/lit/ds/symlink/lm334.pdf; Height: 1.75mm; Mouser Part Number: 926-LM334M/NOPB; Mouser Price/Stock: https://www.mouser.co.uk/ProductDetail/Texas-Instruments/LM334M-NOPB?qs=X1J7HmVL2ZGVqL5LPYoDQw%3D%3D; Arrow Part Number: LM334M/NOPB; Arrow Price/Stock: https://www.arrow.com/en/products/lm334mnopb/texas-instruments?region=nac; ComponentLink1Description: Datasheet; ComponentLink1URL: https://www.ti.com/lit/ds/symlink/lm134.pdf?ts=1700986476311&ref_url=https%253A%252F%252Fwww.google.com%252F
U12-U14 = LT3080ET#31PBF: Adjustable 1.1A Single Resistor Low Dropout Regulator; Manufacturer_Name: Analog Devices; Datasheet Link: https://www.analog.com/media/en/technical-documentation/data-sheets/3080fc.pdf; Height: 15.748mm; Manufacturer_Part_Number: LT3080ET#31PBF; Mouser Part Number: 584-LT3080ET#31PBF; Mouser Price/Stock: https://www.mouser.co.uk/ProductDetail/Analog-Devices/LT3080ET31PBF?qs=hVkxg5c3xu%252BqtsodQH9qig%3D%3D; Arrow Part Number: LT3080ET#31PBF; Arrow Price/Stock: https://www.arrow.com/en/products/lt3080et31pbf/analog-devices?region=nac; ComponentLink1Description: Datasheet; ComponentLink1URL: https://www.analog.com/media/en/technical-documentation/data-sheets/lt3080.pdf

## Sheet output&ext-modules.SchDoc
size A4; SheetNumber: 5; SheetTotal: 5
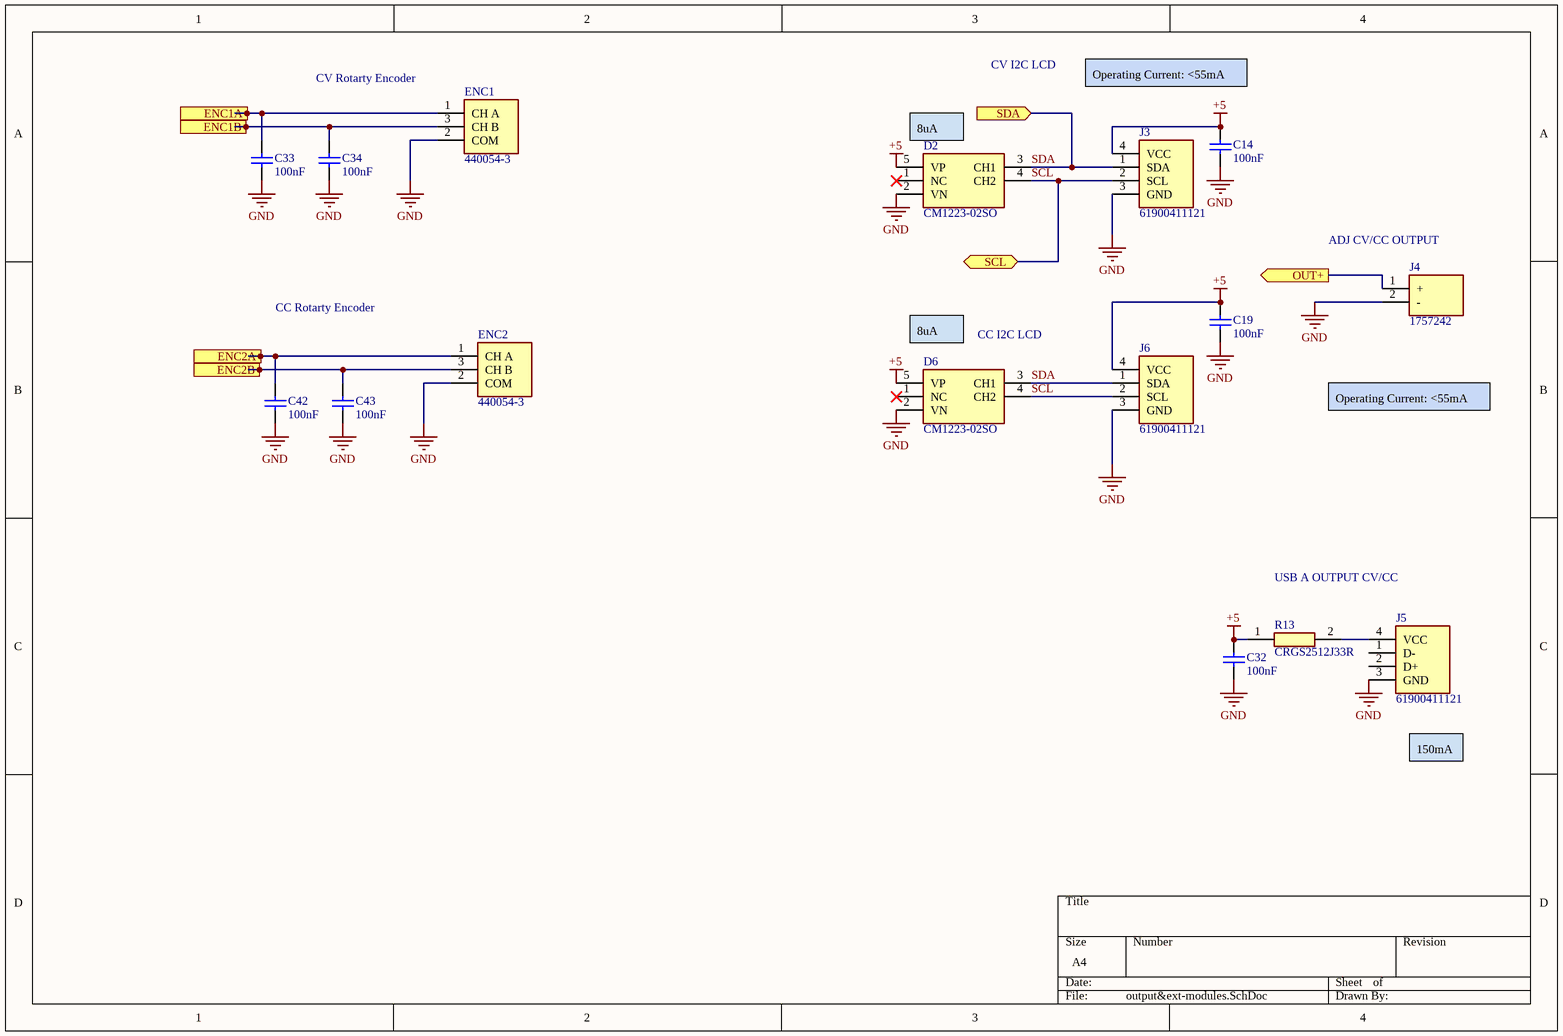
[diagram p4: output&ext-modules.SchDoc]

### Parts
C14  value 100nF  [Cap_0603]  (hidden comment: Cap)
C19  value 100nF  [Cap_0603]  (hidden comment: Cap)
C32  value 100nF  [Cap_0603]  (hidden comment: Cap)
C33  value 100nF  [Cap_0603]  (hidden comment: Cap)
C34  value 100nF  [Cap_0603]  (hidden comment: Cap)
C42  value 100nF  [Cap_0603]  (hidden comment: Cap)
C43  value 100nF  [Cap_0603]  (hidden comment: Cap)
D2  CM1223-02SO  [SOT95P280X145-5N]
D6  CM1223-02SO  [SOT95P280X145-5N]
ENC1  440054-3  [SHDR3W50P0X200_1X3_800X470X635P]
ENC2  440054-3  [SHDR3W50P0X200_1X3_800X470X635P]
J3  61900411121  [SHDR4W64P0X254_1X4_1020X580X1175P]
J4  1757242  [1757242]
J5  61900411121  [SHDR4W64P0X254_1X4_1020X580X1175P]
J6  61900411121  [SHDR4W64P0X254_1X4_1020X580X1175P]
R13  CRGS2512J33R  [RESC6432X65N]

### Ports
ENC1A (out), ENC1B (out), ENC2A (out), ENC2B (out), OUT+ (out), SCL (bidir), SDA (in)

### Nets
+5: C14.1 C19.1 C32.1 D2.5(VP) D6.5(VP) J3.4(VCC) J6.4(VCC) R13.1
GND: C14.2 C19.2 C32.2 C33.2 C34.2 C42.2 C43.2 D2.2(VN) D6.2(VN) ENC1.2(COM) ENC2.2(COM) J3.3(GND) J4.2(-) J5.3(GND) J6.3(GND)
SCL: D2.4(CH2) D6.4(CH2) J3.2(SCL) J6.2(SCL) ; port SCL
SDA: D2.3(CH1) D6.3(CH1) J3.1(SDA) J6.1(SDA) ; port SDA
SUPPLY_OUT: J4.1(+) ; port OUT+
NetC33_1: C33.1 ENC1.1(CH_A) ; port ENC1A
NetC34_1: C34.1 ENC1.3(CH_B) ; port ENC1B
NetC42_1: C42.1 ENC2.1(CH_A) ; port ENC2A
NetC43_1: C43.1 ENC2.3(CH_B) ; port ENC2B
NetJ5_4: J5.4(VCC) R13.2

Not connected (* = marked no-connect by the designer): D2 1(NC)*; D6 1(NC)*; J5 1(D-) 2(D+)

### Notes on the sheet
- CV Rotarty Encoder
- CV I2C LCD
- Operating Current: <55mA
- (near D2) 8uA
- (near J4) ADJ CV/CC OUTPUT
- CC Rotarty Encoder
- (near D6) 8uA
- (near D6) CC I2C LCD
- USB A OUTPUT CV/CC
- 150mA

### Library data of the parts
C14 C19 C32-C34 C42 C43 = Cap: Capacitor; Published: 8-Jun-2000; LatestRevisionDate: 17-Jul-2002; LatestRevisionNote: Re-released for DXP Platform.; PackageReference: RAD-0.3; Publisher: Altium Limited; PackageDescription: Radial Cap, Thru-Hole; 2 Leads; 0.3 in Pin Spacing
D2 D6 = CM1223-02SO: as D1 on sheet v2-DCSupplyHub; Datasheet Link: https://www.onsemi.com/pdf/datasheet/cm1223-d.pdf; Height: 1.45mm; Manufacturer_Part_Number: CM1223-02SO; Mouser Part Number: 748-CM1223-02SO; Mouser Price/Stock: https://www.mouser.co.uk/ProductDetail/onsemi/CM1223-02SO?qs=lLuKAerq7nnvVg3rEtIojA%3D%3D; ComponentLink1Description: Datasheet; ComponentLink1URL: https://www.onsemi.com/pdf/datasheet/cm1223-d.pdf
ENC1 ENC2 = 440054-3: Connector; Manufacturer_Name: TE Connectivity; Datasheet Link: https://www.te.com/commerce/DocumentDelivery/DDEController?Action=srchrtrv&DocNm=440054&DocType=Customer+Drawing&DocLang=English&DocFormat=pdf&PartCntxt=440054-3; Height: 6.35mm; Manufacturer_Part_Number: 440054-3; Mouser Part Number: 571-440054-3; Mouser Price/Stock: https://www.mouser.co.uk/ProductDetail/TE-Connectivity/440054-3?qs=JFPmFzpscO5ATC%252BmN3ka1Q%3D%3D; Arrow Part Number: 440054-3; Arrow Price/Stock: https://www.arrow.com/en/products/440054-3/te-connectivity?region=nac; ComponentLink1Description: Encoder Datasheet; ComponentLink1URL: https://www.farnell.com/datasheets/3750970.pdf
J3 J5 J6 = 61900411121: Connector; Manufacturer_Name: Wurth Elektronik; Datasheet Link: https://katalog.we-online.de/em/datasheet/6190xx11121.pdf; Height: 11.75mm; Manufacturer_Part_Number: 61900411121; Mouser Part Number: 710-61900411121; Mouser Price/Stock: https://www.mouser.co.uk/ProductDetail/Wurth-Elektronik/61900411121?qs=W%252B2sBeLta1Z79%252BA04MeSCQ%3D%3D
  J3 J6: ComponentLink1Description: LCD Datasheet; ComponentLink1URL: https://www.farnell.com/datasheets/3708797.pdf
  J5: ComponentLink1Description: USB A; ComponentLink1URL: https://www.te.com/usa-en/product-1932258-1.datasheet.pdf
J4 = 1757242: Connector; Manufacturer_Name: Phoenix Contact; Datasheet Link: http://www.phoenixcontact.com/de/produkte/1757242/pdf; Height: 8.72mm; Manufacturer_Part_Number: 1757242; Mouser Part Number: 651-1757242; Mouser Price/Stock: https://www.mouser.co.uk/ProductDetail/Phoenix-Contact/1757242?qs=uD%2FdkN7XIa3Ejiz9qDxlzw%3D%3D; Arrow Part Number: 1757242; Arrow Price/Stock: https://www.arrow.com/en/products/1757242/phoenix-contact?region=nac; ComponentLink1Description: Datasheet; ComponentLink1URL: http://www.phoenixcontact.com/de/produkte/1757242/pdf
R13 = CRGS2512J33R: SMD Chip Resistor, 33 ohm, ± 5%, 1.5 W, 2512 [6432 Metric], Thick Film, Anti-Surge; Manufacturer_Name: TE Connectivity; Datasheet Link: http://www.te.com/commerce/DocumentDelivery/DDEController?Action=showdoc&DocId=Data+Sheet%7F9-1773463-8%7FB%7Fpdf%7FEnglish%7FENG_DS_9-1773463-8_B.pdf%7F3-2176251-0; Height: 0.65mm; Manufacturer_Part_Number: CRGS2512J33R; ComponentLink1Description: Datasheet; ComponentLink1URL: https://www.farnell.com/datasheets/2027916.pdf

## Nets that join several sheets
3.3V: v2-DCSupplyHub (C12.2 R11.1 R43.1 U6.5), VCONV-DAC (7 pins)
+5: v2-DCSupplyHub (21 pins), PWM-DAC-PSU (C18.1 R9.2 U7.4), output&ext-modules (8 pins)
+30V_ADJ: VCONV-DAC (5 pins), PWM-DAC-PSU (9 pins)
+36V: v2-DCSupplyHub (7 pins), VCONV-DAC (7 pins)
GND: v2-DCSupplyHub (33 pins), VCONV-DAC (27 pins), PWM-DAC-PSU (22 pins), output&ext-modules (15 pins)
NetC28_1: v2-DCSupplyHub (U5.36), PWM-DAC-PSU (C28.1 R38.2 U3.5)
NetC33_1: v2-DCSupplyHub (U5.8), output&ext-modules (C33.1 ENC1.1)
NetC34_1: v2-DCSupplyHub (U5.9), output&ext-modules (C34.1 ENC1.3)
NetC42_1: v2-DCSupplyHub (U5.10), output&ext-modules (C42.1 ENC2.1)
NetC43_1: v2-DCSupplyHub (U5.11), output&ext-modules (C43.1 ENC2.3)
NetQ2_1: v2-DCSupplyHub (U5.1), PWM-DAC-PSU (Q2.1)
NetR32_2: VCONV-DAC (U11.1), PWM-DAC-PSU (R32.2)
NetU3_3: VCONV-DAC (U16.1), PWM-DAC-PSU (U3.3)
NetU5_42: v2-DCSupplyHub (U5.42), VCONV-DAC (U11.6 U15.2 U16.6)
SCL: v2-DCSupplyHub (R3.1 U5.18), VCONV-DAC (U10.5 U11.5 U16.5), PWM-DAC-PSU (U7.5), output&ext-modules (D2.4 D6.4 J3.2 J6.2)
SDA: v2-DCSupplyHub (R2.1 U5.19), VCONV-DAC (U10.4 U11.4 U16.4), PWM-DAC-PSU (U7.6), output&ext-modules (D2.3 D6.3 J3.1 J6.1)
SUPPLY_OUT: PWM-DAC-PSU (8 pins), output&ext-modules (J4.1)